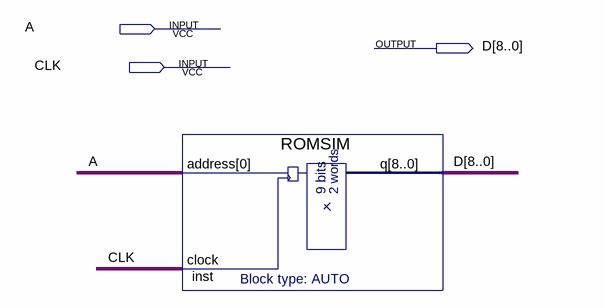
[diagram p0: schematic sheet]
// Quartus schematic ROMSchema.bdf as structural Verilog: 1 symbols, 3 pins
module ROMSchema (
  input  A,
  input  CLK,
  output [8:0] D
);

  ROMSIM inst (.address(A), .clock(CLK), .q(D));
endmodule
